# Altium schematic sheet machkhoasodientu.SchDoc: machkhoasodientu
size A3; SheetNumber: 1; SheetTotal: 1
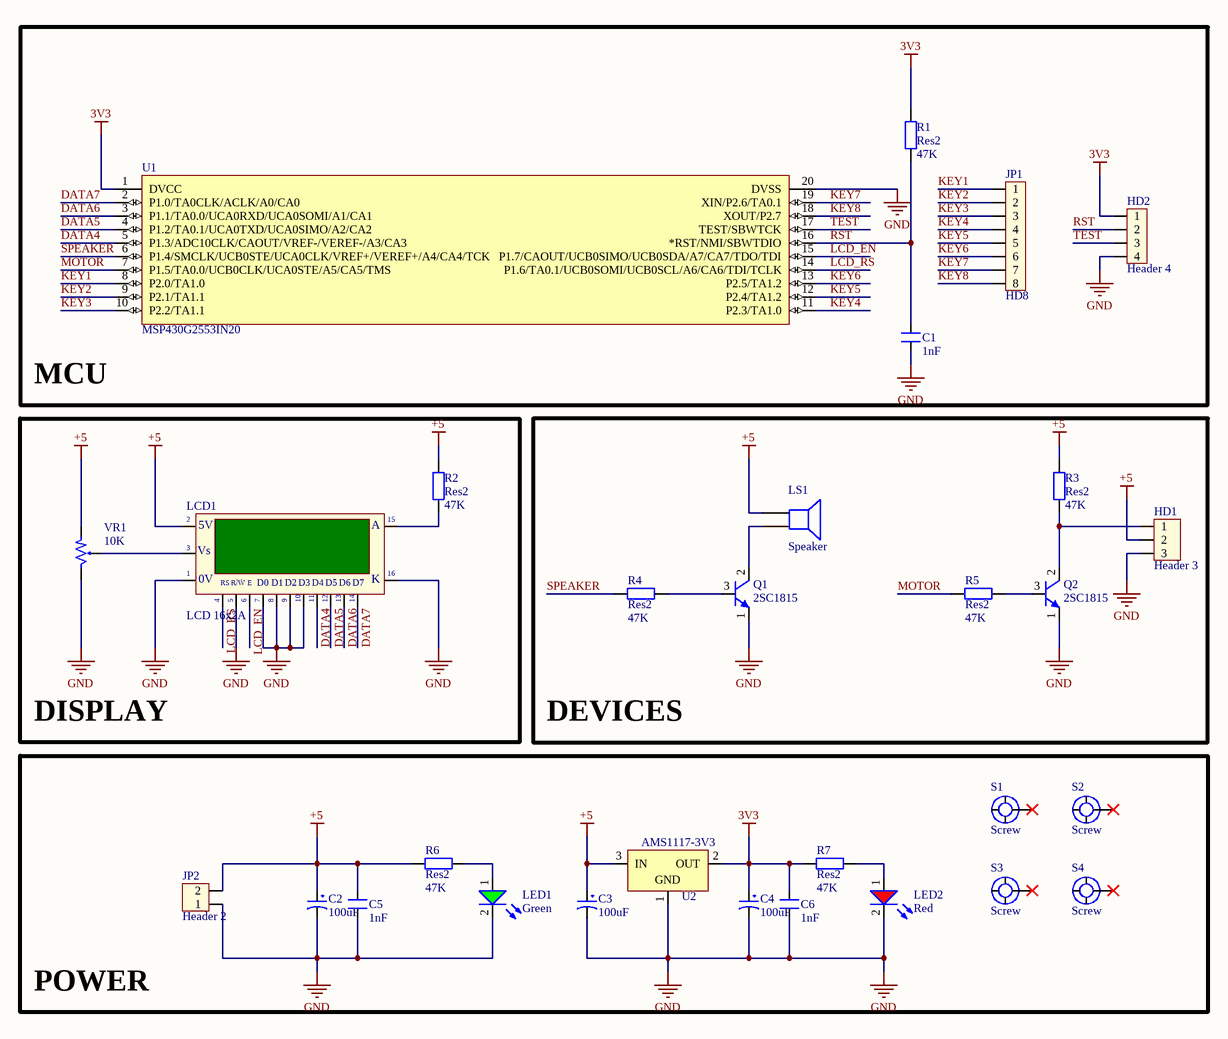
[diagram p0: machkhoasodientu.SchDoc]

## Parts
C1  1nF  [CN1]
C2  100uF  [CP1/2.5]
C3  100uF  [CP1/2.5]
C4  100uF  [CP1/2.5]
C5  1nF  [CN1]
C6  1nF  [CN1]
HD1  Header 3  [Header_3]
HD2  Header 4  [Header_4]
JP1  HD8  [Header_8]
JP2  Header 2  [Header_2]
LCD1  LCD 16x2A  [LCD16x2]
LED1  value Green  [LED3G]  (hidden comment: LED_G_3)
LED2  value Red  [LED3R]  (hidden comment: LED_R_3)
LS1  Speaker  [SPEAKER]
Q1  2SC1815  [2SC1815]
Q2  2SC1815  [2SC1815]
R1  Res2  value 47K  [RES 1/4W CFR25]
R2  Res2  value 47K  [RES 1/4W CFR25]
R3  Res2  value 47K  [RES 1/4W CFR25]
R4  Res2  value 47K  [RES 1/4W CFR25]
R5  Res2  value 47K  [RES 1/4W CFR25]
R6  Res2  value 47K  [RES 1/4W CFR25]
R7  Res2  value 47K  [RES 1/4W CFR25]
S1  Screw  [Screw 3 small]
S2  Screw  [Screw 3 small]
S3  Screw  [Screw 3 small]
S4  Screw  [Screw 3 small]
U1  MSP430G2553IN20  [MSP430G2553]
U2  AMS1117-3V3  [AMS1117-3.3V]
VR1  10K  [VR1]

## Blocks framed on the sheet
MCU: C1 HD2 JP1 R1 U1
DISPLAY: LCD1 R2 VR1
DEVICES: HD1 LS1 Q1 Q2 R3-R5
POWER: C2-C6 JP2 LED1 LED2 R6 R7 S1-S4 U2

## Nets
3V3: C4.1 C6.2 HD2.1 R1.2 R7.2 U1.1(DVCC) U2.2(OUT)
+5: C2.1 C3.1 C5.2 HD1.2 JP2.2 LCD1.2(VDD) LS1.1 R2.2 R3.2 R6.2 U2.3(IN) VR1.1
GND: C1.1 C2.2 C3.2 C4.2 C5.1 C6.1 HD1.3 HD2.4 JP2.1 LCD1.1(GND) LCD1.5(R/~{W}) LCD1.7(D0) LCD1.8(D1) LCD1.9(D2) LCD1.10(D3) LCD1.16(K) LED1.2(K) LED2.2(K) Q1.1(E) Q2.1(E) U1.20(DVSS) U2.1(GND) VR1.3
DATA4: LCD1.11(D4) U1.5(P1.3/ADC10CLK/CAOUT/VREF-/VEREF-/A3/CA3)
DATA5: LCD1.12(D5) U1.4(P1.2/TA0.1/UCA0TXD/UCA0SIMO/A2/CA2)
DATA6: LCD1.13(D6) U1.3(P1.1/TA0.0/UCA0RXD/UCA0SOMI/A1/CA1)
DATA7: LCD1.14(D7) U1.2(P1.0/TA0CLK/ACLK/A0/CA0)
KEY1: JP1.1 U1.8(P2.0/TA1.0)
KEY2: JP1.2 U1.9(P2.1/TA1.1)
KEY3: JP1.3 U1.10(P2.2/TA1.1)
KEY4: JP1.4 U1.11(P2.3/TA1.0)
KEY5: JP1.5 U1.12(P2.4/TA1.2)
KEY6: JP1.6 U1.13(P2.5/TA1.2)
KEY7: JP1.7 U1.19(XIN/P2.6/TA0.1)
KEY8: JP1.8 U1.18(XOUT/P2.7)
LCD_EN: LCD1.6(~{EN}) U1.15(P1.7/CAOUT/UCB0SIMO/UCB0SDA/A7/CA7/TDO/TDI)
LCD_RS: LCD1.4(RS) U1.14(P1.6/TA0.1/UCB0SOMI/UCB0SCL/A6/CA6/TDI/TCLK)
MOTOR: R5.2 U1.7(P1.5/TA0.0/UCB0CLK/UCA0STE/A5/CA5/TMS)
RST: C1.2 HD2.2 R1.1 U1.16(*RST/NMI/SBWTDIO)
SPEAKER: R4.2 U1.6(P1.4/SMCLK/UCB0STE/UCA0CLK/VREF+/VEREF+/A4/CA4/TCK)
TEST: HD2.3 U1.17(TEST/SBWTCK)
NetHD1_1: HD1.1 Q2.2(C) R3.1
NetLCD1_3: LCD1.3(VEE) VR1.2
NetLCD1_15: LCD1.15(A) R2.1
NetLED1_1: LED1.1(A) R6.1
NetLED2_1: LED2.1(A) R7.1
NetLS1_2: LS1.2 Q1.2(C)
NetQ1_3: Q1.3(B) R4.1
NetQ2_3: Q2.3(B) R5.1

Not connected (* = marked no-connect by the designer): S1 1*; S2 1*; S3 1*; S4 1*; U2 4(OUT)

## Notes on the sheet
- (in symbol LCD16x2A) 5V; Vs; |; 0V; R/W; E

## Library data of the parts
C1 C5 C6 = CN1: Cap np  1pF - 472pF; Value: 100pF
C2-C4 = CP2: C 47uF/50V , 220uF/16V; Value: 47uF/16 - 50V; Description 1: 470uF/6,3V - 330uF/10V - 220uF/16V; Description 2: 100uF/25V - 35V - 47uF/50V - 22uF/100V; Description 3: 33uF => 47uF/63V - 1uF => 4,7uF/160V; Description 4: 1uF => 2,2uF/250V - 1uF/350V
HD1 = Header3: Value: Header 3
HD2 = Header4: Value: Header 4
JP1 = Header8: Header 8; Creat by: VanDungEvn@Gmail.com
JP2 = Header2: Value: Header 2
LCD1 = LCD16x2A: LCD dipslay 16 char, 2 line; Value: LCD16x2A
LED1 = LED_GREEN_3MM: LED Green 3mm; ComponentLink1Description: Datasheet; ComponentLink1URL: D:\Dropbox\Datasheets\Opto and Illumination\LEDs\SMD LED.pdf; Unit Price: 0.0476
LED2 = LED_RED_3MM: LED Red 3mm; ComponentLink1Description: Datasheet; ComponentLink1URL: D:\Dropbox\Datasheets\Opto and Illumination\LEDs\SMD LED.pdf; Unit Price: 0.0476
LS1 = Speaker: Loudspeaker; Published: 24-Mar-1999; LatestRevisionDate: 17-Jul-2002; LatestRevisionNote: Re-released for DXP Platform.; PackageReference: PIN2; Publisher: Altium Limited
Q1 Q2 = 2SC1815: Trans NPN 50V 150mA TO-92; ComponentLink1Description: Datasheet; ComponentLink1URL: D:\Dropbox\Datasheets\Transistors\P Channel Bipolar\2SC1815.pdf; Unit Price: 0.0143
R1-R7 = Res2: Resistor; Published: 8-Jun-2000; LatestRevisionDate: 17-Jul-2002; LatestRevisionNote: Re-released for DXP Platform.; PackageReference: AXIAL-0.4; Publisher: Altium Limited; PackageDescription: Axial Device, Thru-Hole; 2 Leads; 0.4 in Pin Spacing
U1 = MSP430G2553IN20: MCU 16bit 16KB 1.8-3.6V 16MHz DIP20; ComponentLink1Description: Datasheet; ComponentLink1URL: D:\Dropbox\Datasheets\Microcontrolers\MSP430\MSP430x2xx Family\MSP430G2553.pdf; Unit Price: 1.0000
U2 = AMS1117-3V3: Linear Voltage Regulator 3.3V 1A 15V Max SOT-223; ComponentLink1Description: Datasheet; ComponentLink1URL: D:\Dropbox\Datasheets\Power Management ICs\Linear Regulators\AMS1117.pdf; Unit Price: 0.2000
VR1 = VR2: Var Resistor; Value: VR 10K